# EAGLE schematic WallyTest (EAGLE 9.6.2)
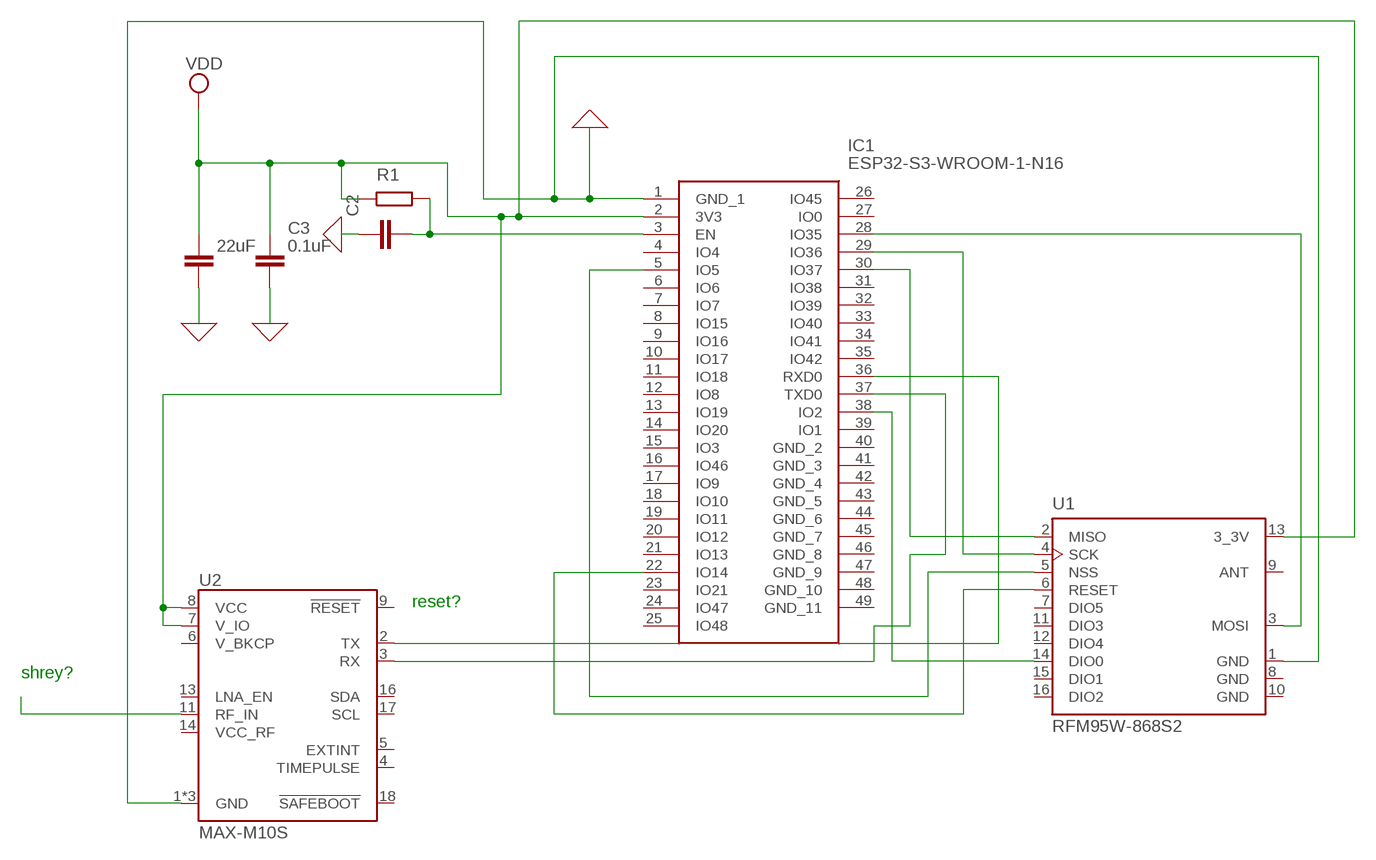
[diagram p0: schematic, sheet 1]

## Parts
C1  22uF  C  (no package)
C2  C  (no package)
C3  0.1uF  C  (no package)
IC1  ESP32-S3-WROOM-1-N16  [ESP32S3WROOM1N16]
R1  R  (no package)
U1  RFM95W-868S2  [XCVR_RFM95W-868S2]
U2  MAX-M10S  [MAX-M10S]

## Nets
0: C1.2 C2.1 C3.2 IC1.1(GND_1) U1.1(GND) U2.1(GND) U2.10(GND) U2.12(GND) ; supply symbol labelled GND
N$1: C2.2 IC1.3(EN) R1.2
N$2: IC1.29(IO36) U1.4(SCK)
N$3: IC1.28(IO35) U1.3(MOSI)
N$4: IC1.30(IO37) U1.2(MISO)
N$5: IC1.38(IO2) U1.14(DIO0)
N$6: IC1.5(IO5) U1.5(NSS)
N$7: IC1.22(IO14) U1.6(RESET)
N$8: IC1.36(RXD0) U2.2(TX)
N$9: IC1.37(TXD0) U2.3(RX)
N$12: U2.11(RF_IN)
VDD: C1.1 C3.1 IC1.2(3V3) R1.1 U1.13(3_3V) U2.7(V_IO) U2.8(VCC)
Unconnected: IC1.4(IO4) IC1.6(IO6) IC1.7(IO7) IC1.8(IO15) IC1.9(IO16) IC1.10(IO17) IC1.11(IO18) IC1.12(IO8) IC1.13(IO19) IC1.14(IO20) IC1.15(IO3) IC1.16(IO46) IC1.17(IO9) IC1.18(IO10) IC1.19(IO11) IC1.20(IO12) IC1.21(IO13) IC1.23(IO21) IC1.24(IO47) IC1.25(IO48) IC1.26(IO45) IC1.27(IO0) IC1.31(IO38) IC1.32(IO39) IC1.33(IO40) IC1.34(IO41) IC1.35(IO42) IC1.39(IO1) IC1.40(GND_2) IC1.41(GND_3) IC1.42(GND_4) IC1.43(GND_5) IC1.44(GND_6) IC1.45(GND_7) IC1.46(GND_8) IC1.47(GND_9) IC1.48(GND_10) IC1.49(GND_11) U1.7(DIO5) U1.9(ANT) U1.11(DIO3) U1.12(DIO4) U1.15(DIO1) U1.16(DIO2) U2.4(TIMEPULSE) U2.5(EXTINT) U2.6(V_BKCP) U2.9(!RESET!) U2.13(LNA_EN) U2.14(VCC_RF) U2.16(SDA) U2.17(SCL) U2.18(!SAFEBOOT!)

## Notes on the sheet
- reset?
- shrey?

## Power pins joined to a net without a drawn wire
GND: U1.8(GND) U1.10(GND)

## Library data of the parts
C1-C3 = ngspice-simulation:C: CAPACITOR
IC1 = ESP32-S3-WROOM-1-N16:ESP32-S3-WROOM-1-N16: WiFi Modules - 802.11 [Engineering Samples] SMD Module, ESP32-S3, 16 MB SPI Flash, PCB Antenna Source: Datasheet <https://www.espressif.com/sites/default/files/documentation/esp32-s3-wroom-1_wroom-1u_datasheet_en.pdf>; DESCRIPTION: WiFi Modules - 802.11 [Engineering Samples] SMD Module, ESP32-S3, 16 MB SPI Flash, PCB Antenna; HEIGHT: 3.25mm; MANUFACTURER_NAME: Espressif Systems; MANUFACTURER_PART_NUMBER: ESP32-S3-WROOM-1-N16; MOUSER_PART_NUMBER: 356-ESP32S3WROOM1N16; MOUSER_PRICE-STOCK: https://www.mouser.co.uk/ProductDetail/Espressif-Systems/ESP32-S3-WROOM-1-N16?qs=Li%252BoUPsLEntjPrtJwwS5Pw%3D%3D
R1 = ngspice-simulation:R: RESISTOR
U1 = RFM95W-868S2:RFM95W-868S2: Mod Txrx Lora +20dbm 868mhz Smd Check availability <https://pricing.snapeda.com/parts/RFM95W-868S2/RF/view-part?ref=eda>; AVAILABILITY: In Stock; DESCRIPTION: General ISM < 1GHz LoRa™ Transceiver Module 868MHz Antenna Not Included Surface Mount; MF: RF; MP: RFM95W-868S2; PACKAGE: Non Standard RF Solutions; PRICE: None; PURCHASE-URL: https://pricing.snapeda.com/search/part/RFM95W-868S2/?ref=eda
U2 = gps:MAX-M10S; PROD_ID: IC-15926